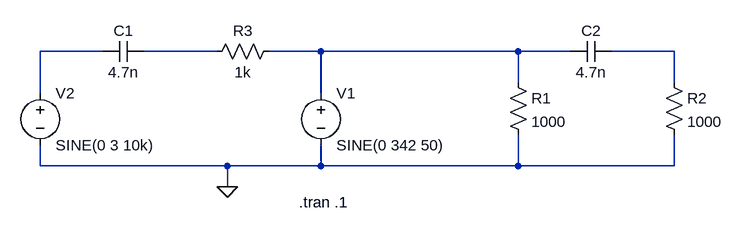
[diagram p0: schematic secteur1.asc]
secteur1.asc, the LTspice schematic file:
Version 4
SHEET 1 880 680
WIRE -336 96 -432 96
WIRE -160 96 -272 96
WIRE 0 96 -80 96
WIRE 304 96 0 96
WIRE 384 96 304 96
WIRE 544 96 448 96
WIRE 304 144 304 96
WIRE 544 144 544 96
WIRE -432 160 -432 96
WIRE 0 160 0 96
WIRE -432 272 -432 240
WIRE -144 272 -432 272
WIRE 0 272 0 240
WIRE 0 272 -144 272
WIRE 304 272 304 224
WIRE 304 272 0 272
WIRE 544 272 544 224
WIRE 544 272 304 272
WIRE -144 304 -144 272
FLAG -144 304 0
SYMBOL voltage 0 144 R0
WINDOW 123 0 0 Left 0
WINDOW 39 0 0 Left 0
SYMATTR InstName V1
SYMATTR Value SINE(0 342 50)
SYMBOL cap -272 80 R90
WINDOW 0 0 32 VBottom 2
WINDOW 3 32 32 VTop 2
SYMATTR InstName C1
SYMATTR Value 4.7n
SYMBOL voltage -432 144 R0
WINDOW 123 0 0 Left 0
WINDOW 39 0 0 Left 0
SYMATTR InstName V2
SYMATTR Value SINE(0 3 10k)
SYMBOL cap 448 80 R90
WINDOW 0 0 32 VBottom 2
WINDOW 3 32 32 VTop 2
SYMATTR InstName C2
SYMATTR Value 4.7n
SYMBOL res 288 128 R0
SYMATTR InstName R1
SYMATTR Value 1000
SYMBOL res 528 128 R0
SYMATTR InstName R2
SYMATTR Value 1000
SYMBOL res -64 80 R90
WINDOW 0 0 56 VBottom 2
WINDOW 3 32 56 VTop 2
SYMATTR InstName R3
SYMATTR Value 1k
TEXT -34 328 Left 2 !.tran .1

The netlist it stands for:
* secteur1.asc
V1 N003 0 SINE(0 342 50)
C1 N002 N001 4.7n
V2 N001 0 SINE(0 3 10k)
C2 N004 N003 4.7n
R1 N003 0 1000
R2 N004 0 1000
R3 N003 N002 1k
.tran .1
.backanno
.end